# EAGLE design el_wirecontroller (EAGLE 6.5.0)
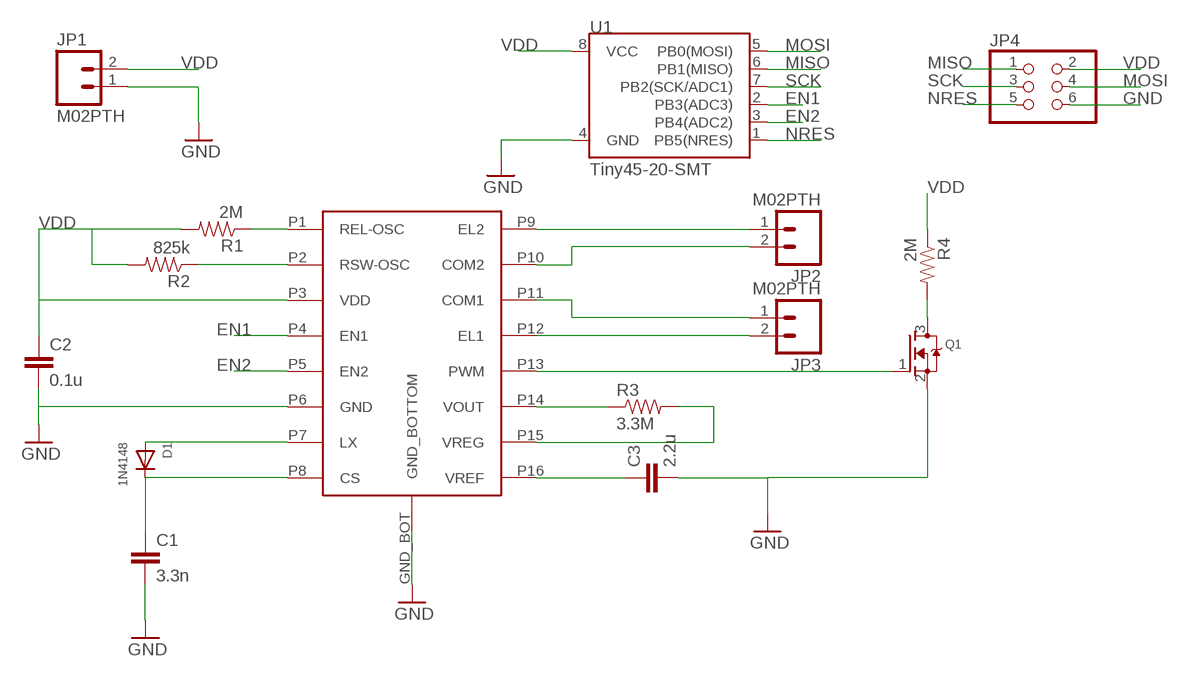
[diagram p0: schematic, sheet 1]

## Parts
C1  3.3n  CAP0402-CAP  [0402-CAP]
C2  0.1u  CAP0402-CAP  [0402-CAP]
C3  2.2u  CAP0402-CAP  [0402-CAP]
D1  1N4148  DIODEDO-1N4148  [DO-1N4148]
JP1  M02PTH  [1X02]
JP2  M02PTH  [1X02]
JP3  M02PTH  [1X02]
JP4  PINHD-2X3  [2X03]
Q1  MOSFET-NREFLOW  [SOT23]
R1  2M  RESISTOR0402-RES  [0402-RES]
R2  825k  RESISTOR0402-RES  [0402-RES]
R3  3.3M  RESISTOR0402-RES  [0402-RES]
R4  2M  RESISTOR0402-RES  [0402-RES]
U1  Tiny45-20-SMT  ATTINY45TINY45-20-SMT  [SO08-EIAJ]
U$1  HV861  [QFN-16]

## Nets
EN1: U1.2(PB3(ADC3)) U$1.P4(EN1)
EN2: U1.3(PB4(ADC2)) U$1.P5(EN2)
GND: C1.2 C2.2 C3.2 JP1.1 JP4.6 Q1.2(S) U1.4(GND) U$1.GND_BOT(GND_BOTTOM) U$1.P6(GND)
MISO: JP4.1 U1.6(PB1(MISO))
MOSI: JP4.4 U1.5(PB0(MOSI))
N$1: R1.1 U$1.P1(REL-OSC)
N$2: R2.1 U$1.P2(RSW-OSC)
N$3: Q1.1(G) U$1.P13(PWM)
N$4: C3.1 U$1.P16(VREF)
N$6: D1.A U$1.P7(LX)
N$7: C1.1 D1.C U$1.P8(CS)
N$8: JP2.1 U$1.P9(EL2)
N$9: R3.1 U$1.P14(VOUT)
N$10: R3.2 U$1.P15(VREG)
N$11: JP2.2 U$1.P10(COM2)
N$12: JP3.1 U$1.P11(COM1)
N$13: JP3.2 U$1.P12(EL1)
N$14: Q1.3(D) R4.2
NRES: JP4.5 U1.1(PB5(NRES))
SCK: JP4.3 U1.7(PB2(SCK/ADC1))
VDD: C2.1 JP1.2 JP4.2 R1.2 R2.2 R4.1 U1.8(VCC) U$1.P3(VDD)

## Library data of the parts
C1-C3 = SparkFun-Passives:CAP: Capacitor Standard 0603 ceramic capacitor, and 0.1" leaded capacitor.
D1 = adafruit:DIODE: Diode SMADIODE - SMA Surface Mount Package 20V 1A Schottky Diode Digikey: 641-1014-6-ND DO-1N4148 - Through Hole Small Current Diode SOD-123 20V 1 A (.5mV Vf) Schottky Diode - Digikey: MBRX120TPMSCT-ND SOD-323 10V 570mA (.38mV Vf, 3ns) Schottky Diode - Digikey: ZLLS410CT-ND SOD-523 30V 30mA Schottky Diode (RB751S-40TE61) - Digikey: RB751S-40TE61CT-ND SOT23-R/W - SOT23 Package (R = Solder Paste/Reflow Ovens, W = Hand-Soldering) BAT54Film 40V 300mA - Digikey: 497-7162-1-ND
JP1-JP3 = SparkFun-Connectors:M02: Standard 2-pin 0.1" header. Use with - straight break away headers ( PRT-00116) - right angle break away headers (PRT-00553) - swiss pins (PRT-00743) - machine pins (PRT-00117) - female headers (PRT-00115) Molex polarized connector foot print use with: PRT-08233 with associated crimp pins and housings. 2.54_SCREWTERM for use with PRT-10571. 3.5mm Screw Terminal footprints for PRT-08084 5mm Screw Terminal footprints for use with PRT-08433
JP4 = pinhead:PINHD-2X3: PIN HEADER
Q1 = adafruit:MOSFET-N: N-Channel Mosfet 2N7002E - 60V 260mA SOT23 [Digikey: 2N7002ET1GOSTR-ND] - REEL BSH103 - 30V 850mA SOT23 [Digikey: 568-5013-1-ND]
R1-R4 = SparkFun-Passives:RESISTOR: Resistor Basic schematic elements and footprints for 0603, 1206, and PTH resistors.
U1 = SparkFun-DigitalIC:ATTINY45: Atmel 8-pin 2/4/8kB flash uC; PROD_ID: IC-08922
U$1 = blake_custom:HV861

## Board
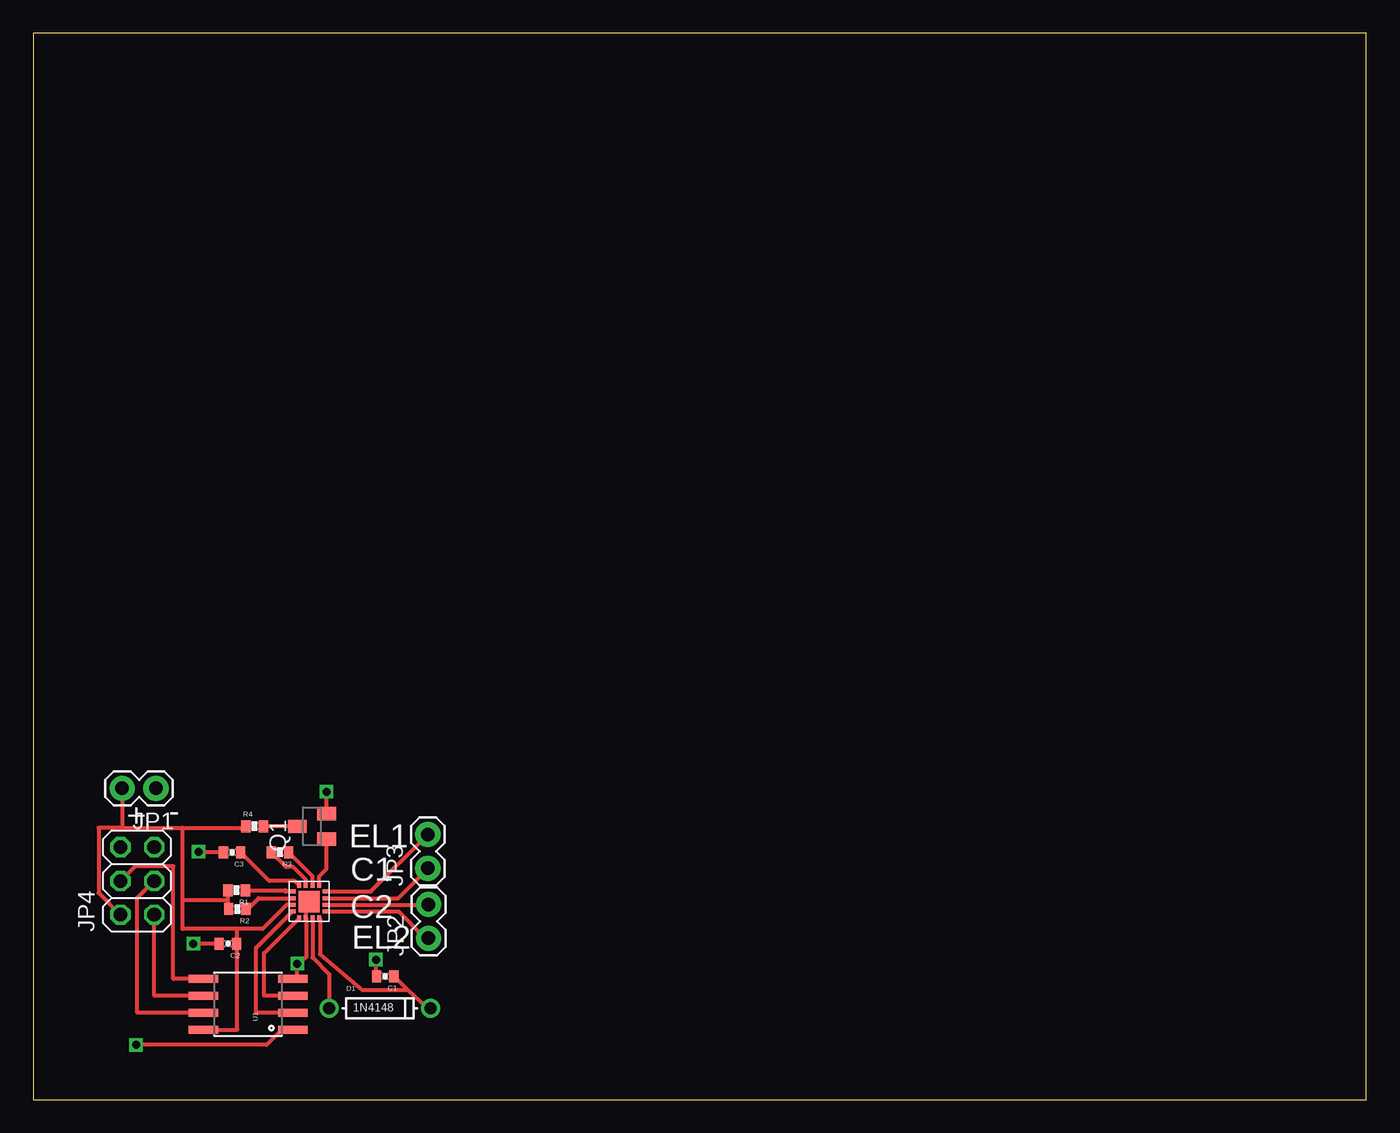
[diagram p1: board, top side]
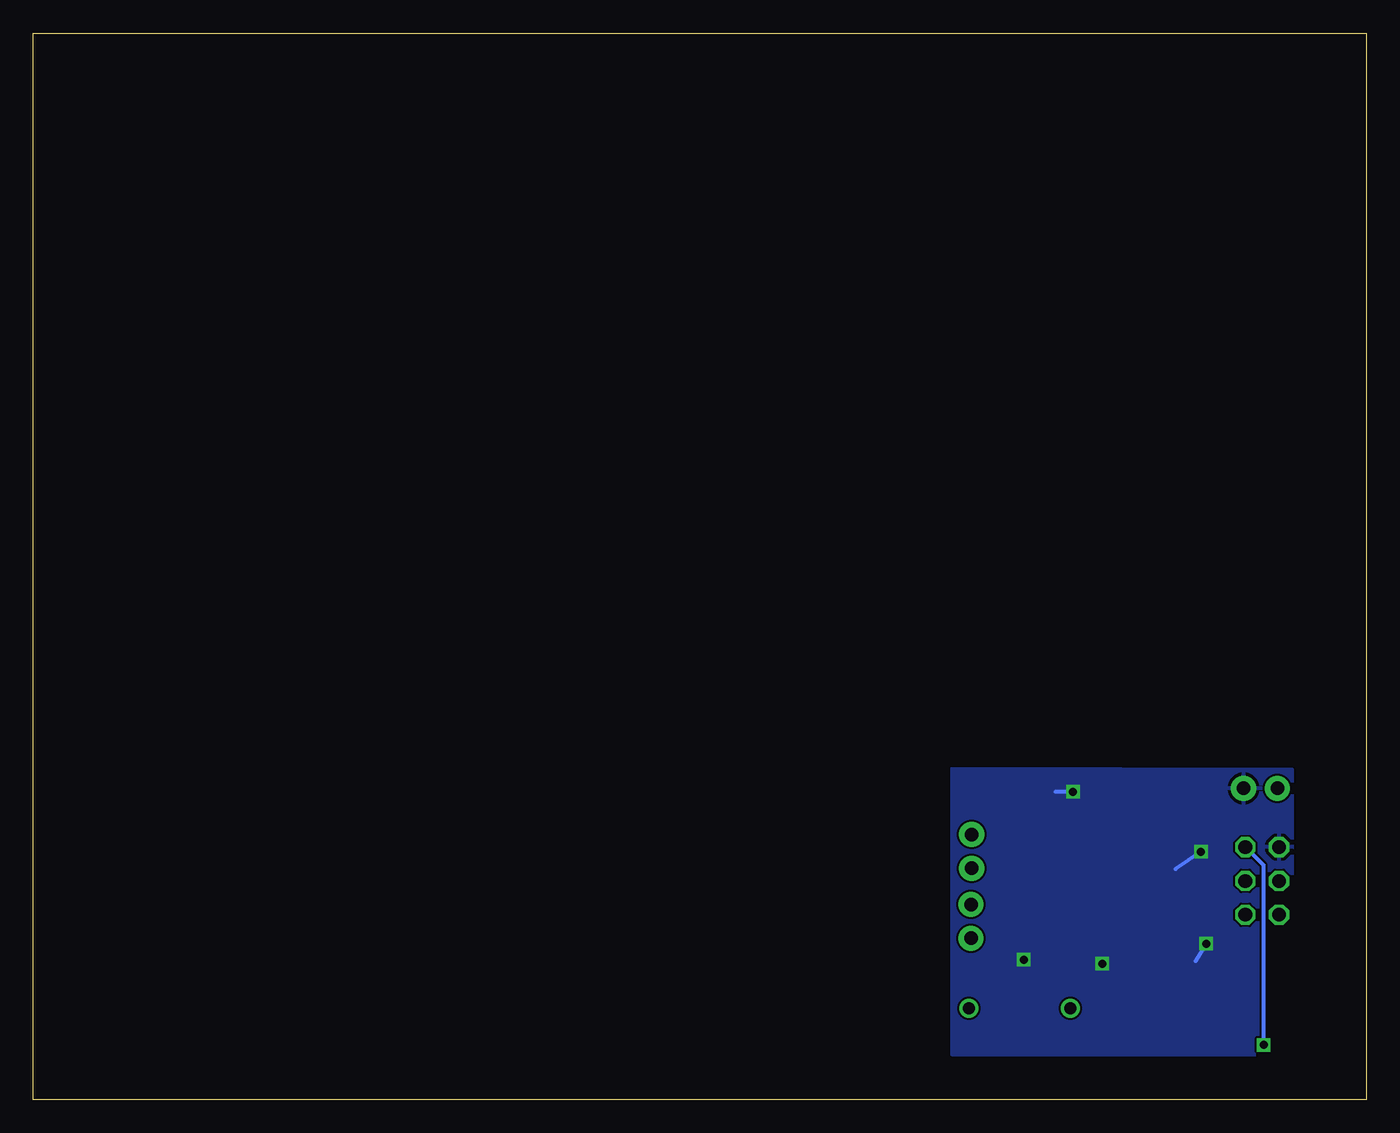
[diagram p2: board, bottom side, seen from below]

Size 100 x 80 mm. Coordinates in mm from the lower left corner, seen from the top.
Outline: 0,0 100,0 100,80 0,80 0,0
Copper layers (1*16): Top 0.035mm / dielectric 1.5mm / Bottom 0.035mm
Design rules "default *": minimum track width 6mil, minimum drill 12mil, track to track 6mil, track to pad 6mil, pad to pad 6mil, via to via 6mil, smd to smd 6mil, copper to edge 8mil, drill to drill 6mil, minimum pad ring 10mil, minimum via ring 8mil, stop-mask expansion 4mil, vias tented up to drill 0mil, thermal gap 10mil

### Footprints (pad centres in the part's own frame; a part is rotated, then mirrored left to right if it is on the bottom)
0402-CAP = smd 0.7 x 0.9: 1 -0.65,0; 2 0.65,0
DO-1N4148 = drill 0.9: A -3.81,0; C 3.81,0
1X02 = drill 1.016 pad 1.88: 1 0,0; 2 2.54,0
2X03 = drill 1.016 octagon: 1 -2.54,-1.27; 2 -2.54,1.27; 3 0,-1.27; 4 0,1.27; 5 2.54,-1.27; 6 2.54,1.27
SOT23 = smd 1 x 1.4: 1 -0.95,-1.1; 2 0.95,-1.1; 3 0,1.1
0402-RES = smd 0.7 x 0.9: 1 -0.65,0; 2 0.65,0
SO08-EIAJ = smd 0.61 x 2.21: 1 -1.905,-3.378; 2 -0.635,-3.378; 3 0.635,-3.378; 4 1.905,-3.378; 5 1.905,3.353; 6 0.635,3.353; 7 -0.635,3.353; 8 -1.905,3.353
QFN-16 = smd 1.6 x 1.6: GND_BOT 1.55,-1.5 | smd 0.45 x 0.3: P1 0.3,-0.75; P2 0.3,-1.25; P3 0.3,-1.75; P4 0.3,-2.25; P9 2.8,-2.25; P10 2.8,-1.75; P11 2.8,-1.25; P12 2.8,-0.75 | smd 0.3 x 0.45: P5 0.8,-2.75; P6 1.3,-2.75; P7 1.8,-2.75; P8 2.3,-2.75; P13 2.3,-0.25; P14 1.8,-0.25; P15 1.3,-0.25; P16 0.8,-0.25

### Placement (x,y rotation side)
C1  26.4,9.25 180 top
C2  14.6,11.7 180 top
C3  14.9,18.55 180 top
D1  26,6.85 0 top
JP1  9.2,23.35 180 top
JP2  29.65,12.1 90 top
JP3  29.6,17.35 90 top
JP4  7.8,16.4 90 top
Q1  20.9,20.5 90 top
R1  15.25,15.7 180 top
R2  15.3,14.3 180 top
R3  18.5,18.55 180 top
R4  16.6,20.5 0 top
U1  16.1,7.15 90 top
U$1  19.14,16.36 0 top

### Tracks (layer width: path | path; a pad name or v marks a point on that pad's centre or on a via)
EN1
  Top 0.305: U1.2 16.7,6.51 16.7,11.4 16.73,11.4 U$1.P4
EN2
  Top 0.305: U1.3 17.3,7.79 17.3,10.97 U$1.P5
GND  (via drill 0.6)
  Top 0.305: U$1.P6 20.45,14.15 20.49,14.85 U$1.GND_BOT | U1.4 19.8,9.05 v19.8,10.2 20.45,10.65 U$1.P6 | U$1.P6 | 14.2,18.55 C3.2 14.2,18.6 v12.4,18.6 | Q1.2 v22,23.1 22,23.15 | C2.2 v12,11.7 | C1.2 25.7,9.25 v25.7,10.5
  Bottom 0.305: v19.8,10.2 19.85,10.2 19.85,9.95 | v12.4,18.6 14.3,17.3 | v22,23.1 23.3,23.1 | v12,11.7 12.8,10.4 | v25.7,10.5 25.6,10.5 25.6,10.6
  pour Bottom: 5.55,24.75 31.1,24.8 31.1,3.4 5.55,3.4
MISO
  Top 0.305: U1.6 9.07,7.79 JP4.1
MOSI
  Top 0.305: U1.5 10.5,9.05 10.5,17.5 7.63,17.5 JP4.4
N$1
  Top 0.305: U$1.P1 18.9,15.61 18.9,15.7 R1.1
N$2
  Top 0.305: R2.1 16.1,14.3 16.9,15.1 U$1.P2
N$3
  Top 0.305: U$1.P13 21.44,16.74 22,17.3 Q1.1
N$4
  Top 0.305: U$1.P16 19.89,16.11 19.6,16.4 17.7,16.4 C3.1
N$6
  Top 0.305: U$1.P7 20.94,10.66 22.2,9.4 D1.A
N$7
  Top 0.305: D1.C 29.45,6.85 29.45,6.95 28.1,8.2 | U$1.P8 21.44,13.56 21.5,13.56 21.5,10.9 24.7,8.2 28.1,8.2 | 28.1,8.2 27.2,9.1 | C1.1 27.2,9.1 | 27.2,9.1 27.2,9.2 27,9.4 27.1,9.4 27.1,9.1
N$8
  Top 0.305: U$1.P9 27.4,14.11 | 27.4,14.11 27.4,14.1 | JP2.1 29.41,12.1 27.4,14.11
N$9
  Top 0.305: U$1.P14 20.94,16.76 R3.1
N$10
  Top 0.305: U$1.P15 20.44,16.51 19.5,17.45 18.95,17.45 R3.2
N$11
  Top 0.305: U$1.P10 29.65,14.61 JP2.2
N$12
  Top 0.305: U$1.P11 27.36,15.11 JP3.1
N$13
  Top 0.305: U$1.P12 25.32,15.61 JP3.2
N$14
  Top 0.305: Q1.3 R4.2
NRES  (via drill 0.6)
  Top 0.305: U1.1 18.64,5.25 17.5,4.1 v7.7,4.1
  Bottom 0.305: v7.7,4.1 7.7,17.57 JP4.5
SCK
  Top 0.305: U1.7 7.8,6.51 7.8,15.13 JP4.3
VDD
  Top 0.305: 6.6,20.4 11.2,20.4 | 11.2,15 11.2,12.8 15.3,12.8 | U$1.P3 19.01,14.61 17.2,12.8 15.3,12.8 | R2.2 14.6,14.3 14.6,15 | 14.6,15 R1.2 | 11.2,15 14.6,15 | 15.3,11.7 15.3,5.25 U1.8 | 15.3,11.7 15.3,12.8 | JP4.2 4.9,15.49 4.9,20.4 6.6,20.4 | 6.6,20.4 6.66,20.46 JP1.2 | 11.2,15 11.2,20.4 | C2.1 15.3,11.7 | 11.2,20.4 16.1,20.4 R4.1

### Text on the board
tPlace: - | + | EL1 | C1 | C2 | EL2